# EasyEDA Pro project ProProject_GD32F103C8t6_2024-04-28.epro

# Schematic Schematic1
Create Date: 2024-04-27; Page Name: P1; Project Name: GD32F103C8t6; Schematic Name: Schematic1; Update Date: 2024-04-28; Company: 嘉立创EDA; Page Size: A4; Version: V1.0
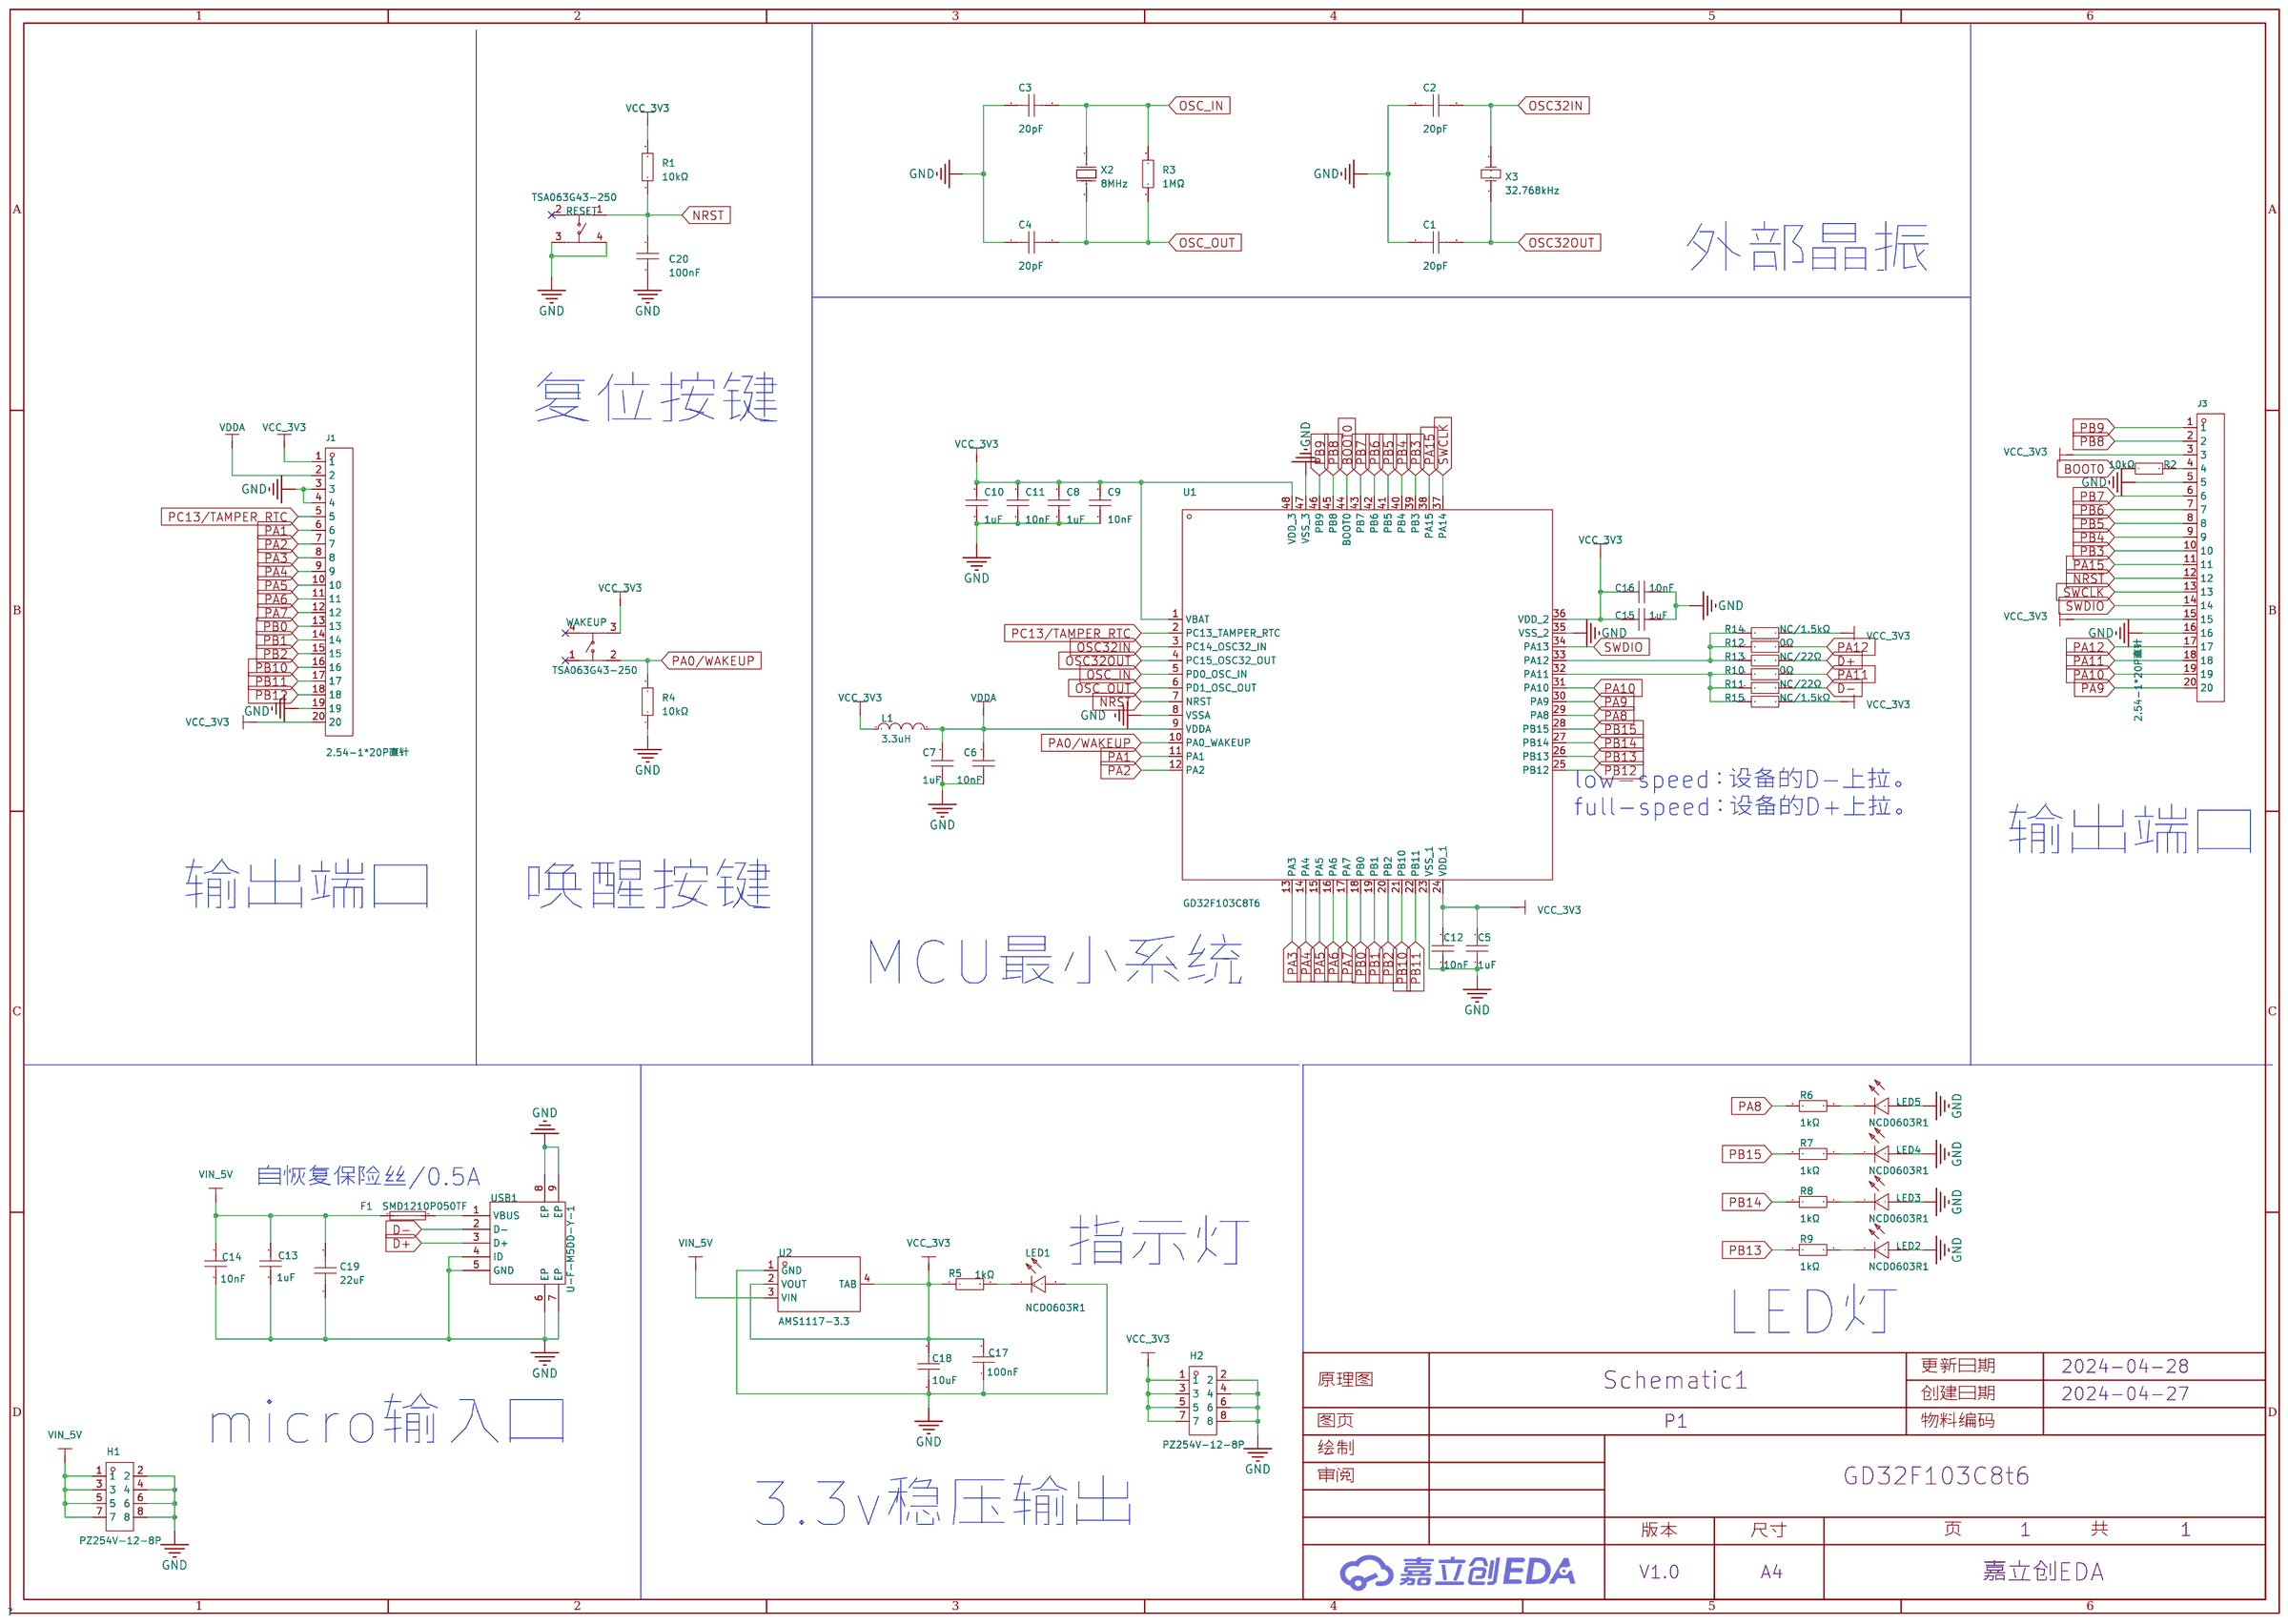
[diagram p0: schematic sheet]

## Parts
C1  20pF  [C0603]
C2  20pF  [C0603]
C3  20pF  [C0603]
C4  20pF  [C0603]
C5  1uF  [C0603]
C6  10nF  [C0603]
C7  1uF  [C0603]
C8  1uF  [C0603]
C9  10nF  [C0603]
C10  1uF  [C0603]
C11  10nF  [C0603]
C12  10nF  [C0603]
C13  1uF  [C0603]
C14  10nF  [C0603]
C15  1uF  [C0603]
C16  10nF  [C0603]
C17  100nF  [C0603]
C18  10uF  [C0805]
C19  22uF  [C0805]
C20  100nF  [C0603]
F1  SMD1210P050TF  [F1210]
H1  PZ254V-12-8P  [HDR-TH_8P-P2.54-V-M-R2-C4-S2.54]
H2  PZ254V-12-8P  [HDR-TH_8P-P2.54-V-M-R2-C4-S2.54]
J1  2.54-1*20P直针  [HDR-TH_20P-P2.54-V-M-1]
J3  2.54-1*20P直针  [HDR-TH_20P-P2.54-V-M-1]
L1  3.3uH  [L0603]
LED1  NCD0603R1  [LED0603-RD_RED]
LED2  NCD0603R1  [LED0603-RD_RED]
LED3  NCD0603R1  [LED0603-RD_RED]
LED4  NCD0603R1  [LED0603-RD_RED]
LED5  NCD0603R1  [LED0603-RD_RED]
R1  10kΩ  [R0603]
R2  10kΩ  [R0603]
R3  1MΩ  [R0603]
R4  10kΩ  [R0603]
R5  1kΩ  [R0603]
R6  1kΩ  [R0603]
R7  1kΩ  [R0603]
R8  1kΩ  [R0603]
R9  1kΩ  [R0603]
R10  0Ω  [R0603]
R11  NC/22Ω  [R0603]
R12  0Ω  [R0603]
R13  NC/22Ω  [R0603]
R14  NC/1.5kΩ  [R0603]
R15  NC/1.5kΩ  [R0603]
RESET  TSA063G43-250  [KEY-SMD_4P-L6.0-W6.0-P4.50-LS10.0]
U1  GD32F103C8T6  [TQFP-48_L7.0-W7.0-P0.50-LS9.0-BL]
U2  AMS1117-3.3  [SOT-223-3_L6.5-W3.5-P3.05-LS7.0]
USB1  U-F-M5DD-Y-1  [MICRO-USB-SMD_U-F-M5DD-Y-1]
WAKEUP  TSA063G43-250  [KEY-SMD_4P-L6.0-W6.0-P4.50-LS10.0]
X2  8MHz  [OSC-TH_L10.0-W4.5-P5.00]
X3  32.768kHz  [OSC-TH_BD3.1-P0.8-D0.3]

## Library data of the parts
C1-C4 = 0603CG200J500NT: 容值:20pF;精度:±5%;额定电压:50V;材质(温度系数):C0G;; LCSC Part Name: 20pF ±5% 50V; Supplier Part: C91702; Manufacturer: FH(风华); Supplier Footprint: 0603; JLCPCB Part Class: 扩展库; Datasheet: https://atta.szlcsc.com/upload/public/pdf/source/20200305/C486355_26A10D38EF8C2A5C37091D0039909270.pdf; Supplier: LCSC; Tolerance: ±5%; Voltage Rated: 50V; Temperature Coefficient: C0G
C5 C7 C8 C10 C13 C15 = CL10A105KP8NNNC: 容值:1uF;精度:±10%;额定电压:10V;材质(温度系数):X5R;; LCSC Part Name: 1uF ±10% 10V; Supplier Part: C26413; Manufacturer: SAMSUNG(三星); Supplier Footprint: 0603; JLCPCB Part Class: 扩展库; Datasheet: https://atta.szlcsc.com/upload/public/pdf/source/20160218/1457707763339.pdf; Supplier: LCSC; Tolerance: ±10%; Voltage Rated: 10V; Temperature Coefficient: X5R
C6 C9 C11 C12 C14 C16 = CC0603KRX7R9BB103: 容值:10nF;精度:±10%;额定电压:50V;材质(温度系数):X7R;; LCSC Part Name: 10nF ±10% 50V; Supplier Part: C100042; Manufacturer: YAGEO(国巨); Supplier Footprint: 0603; JLCPCB Part Class: 扩展库; Datasheet: https://atta.szlcsc.com/upload/public/pdf/source/20181008/C309510_22F155564471FAF6A489F7D68F34234E.pdf; Supplier: LCSC; Tolerance: ±10%; Voltage Rated: 50V; Temperature Coefficient: X7R
C17 C20 = 0603B104K500NT: 容值:100nF;精度:±10%;额定电压:50V;材质(温度系数):X7R;; LCSC Part Name: 100nF ±10% 50V; Supplier Part: C30926; Manufacturer: FH(风华); Supplier Footprint: 0603; JLCPCB Part Class: 扩展库; Datasheet: https://atta.szlcsc.com/upload/public/pdf/source/20200305/C486355_26A10D38EF8C2A5C37091D0039909270.pdf; Supplier: LCSC; Tolerance: ±10%; Voltage Rated: 50V; Temperature Coefficient: X7R
C18 = CL21A106KAYNNNE_C15850: 容值:10uF;精度:±10%;额定电压:25V;材质(温度系数):X5R;; LCSC Part Name: 10uF ±10% 25V; Supplier Part: C15850; Manufacturer: SAMSUNG(三星); Manufacturer Part: CL21A106KAYNNNE; Supplier Footprint: 0805; JLCPCB Part Class: 基础库; Datasheet: https://atta.szlcsc.com/upload/public/pdf/source/20160218/1457707763339.pdf; Supplier: LCSC; Tolerance: ±10%; Voltage Rated: 25V; Temperature Coefficient: X5R
C19 = CL21A226MAQNNNE: 容值:22uF;精度:±20%;额定电压:25V;材质(温度系数):X5R;; LCSC Part Name: 22uF ±20% 25V; Supplier Part: C45783; Manufacturer: SAMSUNG(三星); Supplier Footprint: 0805; JLCPCB Part Class: 基础库; Datasheet: https://atta.szlcsc.com/upload/public/pdf/source/20160218/1457707763339.pdf; Supplier: LCSC; Tolerance: ±20%; Voltage Rated: 25V; Temperature Coefficient: X5R
F1 = SMD1210P050TF: 最大电压:13.2V;最大电流:100A;保持电流:500mA;跳闸电流:1A;; LCSC Part Name: 0.50A 自恢复型; Supplier Part: C15997; Manufacturer: RUILON(瑞隆源); Supplier Footprint: 1210; JLCPCB Part Class: 扩展库; Datasheet: https://atta.szlcsc.com/upload/public/pdf/source/20200427/C15997_F0890E2A0329AD76630862C098BA0840.pdf; Supplier: LCSC; Operating Voltage (Max): 13.2V; Current Rating (Max): 100A; Hold Current: 500mA; Trip Current: 1A
H1 H2 = PZ254V-12-8P: 插针结构:2x4P;间距:2.54mm;行距:2.54mm;圆针/方针:方针;安装类型:直插;排数:双排;总PIN位数:8P;额定电流:-;额定电压:-;配合针长度:6mm;塑高:2.5mm;端接针长度:3mm;触头材质:黄铜;触头镀层:-;工作温度范围:-40℃~+105℃;颜色:黑色;; LCSC Part Name: 间距:2.54mm 2x4P 直插 方针; Supplier Part: C492421; Manufacturer: XFCN(兴飞); Supplier Footprint: 插件,P=2.54mm; JLCPCB Part Class: 扩展库; Datasheet: https://atta.szlcsc.com/upload/public/pdf/source/20200309/C492421_DC8A206AF99CD7755BD4A5B0BC48200B.pdf; Supplier: LCSC; Pin Structure: 2x4P; Pitch: 2.54mm; Row Spacing: 2.54mm; Circluar Pins/Square Pins: 方针; Mounting Type: 直插; Number of Rows: 双排; Number of Pins: 8P; Length of Mating Pin: 6mm; Insulation Height: 2.5mm; Length of End Connection Pin: 3mm; Contact Material: 黄铜; Operating Temperature Range: -40℃~+105℃; Color: 黑色
J1 J3 = 2.54-1*20P直针: 插针结构:1x20P;间距:2.54mm;行距:-;圆针/方针:方针;安装类型:直插;排数:单排;总PIN位数:20P;额定电流:3A;额定电压:-;配合针长度:-;塑高:-;端接针长度:-;触头材质:黄铜;触头镀层:-;工作温度范围:-40℃~+105℃;颜色:黑色;; LCSC Part Name: 间距:2.54mm 1x20P 直插 方针; Supplier Part: C50981; Manufacturer: BOOMELE(博穆精密); Supplier Footprint: 插件,P=2.54mm; JLCPCB Part Class: 扩展库; Datasheet: https://atta.szlcsc.com/upload/public/pdf/source/20151109/1457707572883.pdf; Supplier: LCSC; Pin Structure: 1x20P; Pitch: 2.54mm; Circluar Pins/Square Pins: 方针; Mounting Type: 直插; Number of Rows: 单排; Number of Pins: 20P; Current Rating (Max): 3A; Contact Material: 黄铜; Operating Temperature Range: -40℃~+105℃; Color: 黑色
L1 = CMI160808U3R3KT: 电感值:3.3uH;精度:±10%;额定电流:15mA;饱和电流(Isat):-;直流电阻(DCR):1Ω;; LCSC Part Name: 3.3uH ±10%; Supplier Part: C139209; Manufacturer: FH(风华); Supplier Footprint: 0603; JLCPCB Part Class: 扩展库; Datasheet: https://atta.szlcsc.com/upload/public/pdf/source/20230223/55F203729CE6F04E1707F35DF12034EB.pdf; Supplier: LCSC; Tolerance: ±10%; Rated Current: 15mA; DC Resistance (DCR): 1Ω
LED1-LED5 = NCD0603R1_C84263: 灯头类型:-;发光颜色:红色;正向电压(VF):1.6V~2.6V;功率:65mW;正向电流:20mA;主波长:615nm~630nm;二极管配置:独立二极管;透镜颜色:无色透明透镜;色温:-;发光强度:80mcd~220mcd;发光角度:130°;载带方式:-;工作温度:-30℃~+85℃;; Supplier Part: C84263; Manufacturer: 国星光电; Supplier Footprint: 0603; JLCPCB Part Class: 扩展库; Datasheet: https://atta.szlcsc.com/upload/public/pdf/source/20200820/C84263_DABC6A75E58F576973B407FDBA283D60.pdf; Supplier: LCSC; Emitted Color: 红色; Forward Voltage (VF): 1.6V~2.6V; Power Dissipation: 65mW; Forward Current: 20mA; Dominant Wavelength: 615nm~630nm; Diode Configuration: 独立二极管; Lens Color: 无色透明透镜; Luminous Intensity: 80mcd~220mcd; Viewing Angle: 130°; Operating Temperature: -30℃~+85℃
R1 R2 R4 = RC0603JR-0710KL: 电阻类型:厚膜电阻;阻值:10kΩ;精度:±5%;功率:100mW;最大工作电压:75V;温度系数:±100ppm/℃;; LCSC Part Name: 厚膜电阻 10kΩ ±5% 100mW; Supplier Part: C99198; Manufacturer: YAGEO(国巨); Supplier Footprint: 0603; JLCPCB Part Class: 扩展库; Datasheet: https://atta.szlcsc.com/upload/public/pdf/source/20181223/C99198_917934A193F41F77D9F7D214A8C79116.pdf; Supplier: LCSC; Type: 厚膜电阻; Tolerance: ±5%; Power(Watts): 100mW; Overload Voltage (Max): 75V; Temperature Coefficient: ±100ppm/℃; Operating Temperature Range: -55℃~+155℃
R3 = RC0603JR-071ML: 电阻类型:厚膜电阻;阻值:1MΩ;精度:±5%;功率:100mW;最大工作电压:75V;温度系数:±100ppm/℃;; LCSC Part Name: 厚膜电阻 1MΩ ±5% 100mW; Supplier Part: C107698; Manufacturer: YAGEO(国巨); Supplier Footprint: 0603; JLCPCB Part Class: 扩展库; Datasheet: https://atta.szlcsc.com/upload/public/pdf/source/20180316/70C0E2BDAE7FCC62C531A5A58D202EE1.pdf; Supplier: LCSC; Type: 厚膜电阻; Tolerance: ±5%; Power(Watts): 100mW; Overload Voltage (Max): 75V; Temperature Coefficient: ±100ppm/℃; Operating Temperature Range: -55℃~+155℃
R5-R9 = RT0603BRD071KL: 电阻类型:薄膜电阻;阻值:1kΩ;精度:±0.1%;功率:100mW;最大工作电压:75V;温度系数:±25ppm/℃;; LCSC Part Name: 薄膜电阻 1kΩ ±0.1% 100mW; Supplier Part: C110776; Manufacturer: YAGEO(国巨); Supplier Footprint: 0603; JLCPCB Part Class: 扩展库; Datasheet: https://atta.szlcsc.com/upload/public/pdf/source/20170704/1499151282044.pdf; Supplier: LCSC; Type: 薄膜电阻; Tolerance: ±0.1%; Power(Watts): 100mW; Overload Voltage (Max): 75V; Temperature Coefficient: ±25ppm/℃; Operating Temperature Range: -55℃~+155℃
R10 R12 = 0603WAJ0000T5E: 电阻类型:厚膜电阻;阻值:0Ω;精度:±5%;功率:100mW;最大工作电压:75V;温度系数:±800ppm/℃;; LCSC Part Name: 0Ω ±5% 100mW 厚膜电阻; Supplier Part: C15402; Manufacturer: UNI-ROYAL(厚声); Supplier Footprint: 0603; JLCPCB Part Class: 扩展库; Datasheet: https://atta.szlcsc.com/upload/public/pdf/source/20200306/C422600_1E6D84923E4A46A82E41ADD87F860B5C.pdf; Supplier: LCSC; Type: 厚膜电阻; Tolerance: ±5%; Power(Watts): 100mW; Overload Voltage (Max): 75V; Temperature Coefficient: ±800ppm/℃; Operating Temperature Range: -55℃~+155℃
R11 R13 = RS-03K22R0FT: 电阻类型:厚膜电阻;阻值:22Ω;精度:±1%;功率:100mW;最大工作电压:50V;温度系数:±100ppm/℃;; LCSC Part Name: 厚膜电阻 22Ω ±1% 100mW; Supplier Part: C174301; Manufacturer: FH(风华); Supplier Footprint: 0603; JLCPCB Part Class: 扩展库; Datasheet: https://atta.szlcsc.com/upload/public/pdf/source/20140616/1457707091974.pdf; Supplier: LCSC; Type: 厚膜电阻; Tolerance: ±1%; Power(Watts): 100mW; Overload Voltage (Max): 50V; Temperature Coefficient: ±100ppm/℃; Operating Temperature Range: -55℃~+155℃
R14 R15 = RS-03K1501FT: 电阻类型:厚膜电阻;阻值:1.5kΩ;精度:±1%;功率:100mW;最大工作电压:50V;温度系数:±100ppm/℃;; LCSC Part Name: 厚膜电阻 1.5kΩ ±1% 100mW; Supplier Part: C118397; Manufacturer: FH(风华); Supplier Footprint: 0603; JLCPCB Part Class: 扩展库; Datasheet: https://atta.szlcsc.com/upload/public/pdf/source/20140616/1457707091974.pdf; Supplier: LCSC; Type: 厚膜电阻; Tolerance: ±1%; Power(Watts): 100mW; Overload Voltage (Max): 50V; Temperature Coefficient: ±100ppm/℃; Operating Temperature Range: -55℃~+155℃
RESET WAKEUP = TSA063G43-250: 电路结构:单刀单掷;按钮形状:圆形按钮;作用力:250gf;安装方式:立贴;开关长度:6.1mm;开关宽度:6.1mm;开关高度:4.3mm;带支架:不带;触点电流:50mA;额定电压(DC):12V;绝缘电阻:100MΩ;带灯:无;机械寿命:5万次;; LCSC Part Name: 6.1*6.1*4.3mm 立贴 轻触开关; Supplier Part: C294564; Manufacturer: BRIGHT(博瑞泰); Supplier Footprint: SMD; JLCPCB Part Class: 扩展库; Datasheet: https://atta.szlcsc.com/upload/public/pdf/source/20181029/C294570_15EFF1F4D215547575AD6307D8A439BB.pdf; Supplier: LCSC; Circuit: 单刀单掷; Actuator Style: 圆形按钮; Operating Force: 250gf; Mounting Style: 立贴; Switch Length: 6.1mm; Switch Width: 6.1mm; Switch Height: 4.3mm; Strike Gundam: 不带; Contact Current: 50mA; Voltage Rating (DC): 12V; Insulation Resistance: 100MΩ; Actuator/Cap Color: 黑色; With Lamp: 无; Pin Style: 鸥翼型; Mechanical Life: 5万次; Operating Temperature: -25℃~+70℃
U1 = GD32F103C8T6: CPU内核:CM3;程序存储容量:64KB;RAM总容量:20KB;GPIO端口数量:37;工作电压范围:2.6V~3.6V;CPU最大主频:108MHz;程序存储器类型:FLASH;; LCSC Part Name: Arm® Cortex®-M3 32-bit MCU; Supplier Part: C77994; Manufacturer: GigaDevice(兆易创新); Supplier Footprint: LQFP-48(7x7); JLCPCB Part Class: 扩展库; Datasheet: https://atta.szlcsc.com/upload/public/pdf/source/20160910/1473490296871.pdf; Supplier: LCSC; CPU Core: CM3; Program Storage Size: 64KB; RAM Size: 20KB; GPIO Ports Number: 37; Operating Voltage Range: 2.6V~3.6V; CPU Maximum Speed: 108MHz; Program Memory Type: FLASH; Operating Temperature Range: -40℃~+85℃; ADC (Bit): 12bit; PWM (Bit): 16bit; 16Bit Timer: 3; CAN: 1; UART/USART: 3; I2C: 2; SPI: 2; Universal Serial Bus: 有; Peripheral/Function: 片载温度传感器；DMA；看门狗；LIN总线协议；PWM；IrDA；SDIO；RTC实时时钟; Watchdog: 有; Real-Time Clock: 有; Infrared Data Association: 有; Secure Digital Input and Output: 有; Direct Memory Access: 有; Internal Oscillator: 有
U2 = AMS1117-3.3_C5250992: 输出类型：固定 输出极性：正 最大输入电压：18V 输出电压：3.3V 输出电流：1A 电源纹波抑制比(PSRR)：60dB@(120Hz)。当前应用较多领域：三端稳压器，机顶盒; Supplier Part: C5250992; Manufacturer: TWGMC(台湾迪嘉); Supplier Footprint: SOT-223-3L; JLCPCB Part Class: 扩展库; Datasheet: https://atta.szlcsc.com/upload/public/pdf/source/20221109/A58A92B07670E85D28928AE371260E8D.pdf; Supplier: LCSC
USB1 = U-F-M5DD-Y-1: 连接器类型:Micro-B;标准:USB 2.0;公母:母;端口数量:1;触点数量:5P;额定电流 - 电源:1A;; LCSC Part Name: Micro-B 母; Supplier Part: C91467; Manufacturer: 韩国韩荣; Supplier Footprint: SMD; JLCPCB Part Class: 扩展库; Datasheet: https://atta.szlcsc.com/upload/public/pdf/source/20190321/C91467_7D0E0328BDB3D0105DB79E7E785438EE.pdf; Supplier: LCSC; Connector Type: Micro-B; Standard: USB 2.0; Gender: 母; Number of Ports: 1; Number of Contacts: 5P; Current Rating - Power (Max): 1A
X2 = X49SD8MSD2SC: 晶振类型:直插晶振;频率:8MHz;常温频差:±20ppm;外接负载电容:20pF;频率稳定度(全温):±30ppm;; LCSC Part Name: 8MHz ±20ppm 20pF; Supplier Part: C21263; Manufacturer: YXC(扬兴晶振); Supplier Footprint: HC-49S; JLCPCB Part Class: 扩展库; Datasheet: https://atta.szlcsc.com/upload/public/pdf/source/20240329/977D7F2434F98B2BE33270BB9FF3D86D.pdf; Supplier: LCSC; Crystal Type: 直插晶振; Normal temperature Frequency Tolerance: ±20ppm; External load capacitor: 20pF; Frequency Stability(Full temperature range): ±30ppm; Operating Temperature: -20℃~+70℃
X3 = X308032768KGB2SC: 晶振类型:直插晶振;频率:32.768kHz;常温频差:±10ppm;外接负载电容:12.5pF;频率稳定度(全温):-;; LCSC Part Name: 32.768kHz ±10ppm 12.5pF YT-38; Supplier Part: C52082; Manufacturer: YXC(扬兴晶振); Supplier Footprint: DT-38; JLCPCB Part Class: 扩展库; Datasheet: https://atta.szlcsc.com/upload/public/pdf/source/20240329/231E1A1EB7C875CD193DBE6664A3DE3A.pdf; Supplier: LCSC; Crystal Type: 直插晶振; Normal temperature Frequency Tolerance: ±10ppm; External load capacitor: 12.5pF; Operating Temperature: -20℃~+70℃

## Nets
GND: C1.1 C2.1 C3.1 C4.1 C5.1 C6.1 C7.1 C8.1 C9.1 C10.1 C11.1 C12.1 C13.1 C14.1 C15.1 C16.1 C17.1 C18.1 C19.1 C20.1 H1.2 H1.4 H1.6 H1.8 H2.2 H2.4 H2.6 H2.8 J1.3 J1.4 J1.19 J3.5 J3.16 LED1.2(A) LED2.2(A) LED3.2(A) LED4.2(A) LED5.2(A) R4.1 RESET.3 RESET.4 U1.8(VSSA) U1.23(VSS_1) U1.35(VSS_2) U1.47(VSS_3) U2.1(GND) USB1.4(ID) USB1.5(GND) USB1.6(EP) USB1.7(EP) USB1.8(EP) USB1.9(EP)
VCC_3V3: C5.2 C8.2 C9.2 C10.2 C11.2 C12.2 C15.2 C16.2 C17.2 C18.2 H2.1 H2.3 H2.5 H2.7 J1.1 J1.20 J3.3 J3.15 L1.1 R1.2 R5.1 R14.2 R15.2 U1.1(VBAT) U1.24(VDD_1) U1.36(VDD_2) U1.48(VDD_3) U2.2(VOUT) U2.4(TAB) WAKEUP.3
VDDA: C6.2 C7.2 J1.2 L1.2 U1.9(VDDA)
VIN_5V: C13.2 C14.2 C19.2 F1.1 H1.1 H1.3 H1.5 H1.7 U2.3(VIN)
BOOT0: R2.1 U1.44(BOOT0)
D+: R13.2 USB1.3(D+)
D-: R11.2 USB1.2(D-)
NRST: C20.2 J3.12 R1.1 RESET.1 U1.7(NRST)
OSC32IN: C2.2 U1.3(PC14_OSC32_IN) X3.2(OSC2)
OSC32OUT: C1.2 U1.4(PC15_OSC32_OUT) X3.1(OSC1)
OSC_IN: C3.2 R3.2 U1.5(PD0_OSC_IN) X2.1(OSC1)
OSC_OUT: C4.2 R3.1 U1.6(PD1_OSC_OUT) X2.2(OSC2)
PA0/WAKEUP: R4.2 U1.10(PA0_WAKEUP) WAKEUP.2
PA1: J1.6 U1.11(PA1)
PA2: J1.7 U1.12(PA2)
PA3: J1.8 U1.13(PA3)
PA4: J1.9 U1.14(PA4)
PA5: J1.10 U1.15(PA5)
PA6: J1.11 U1.16(PA6)
PA7: J1.12 U1.17(PA7)
PA8: R6.1 U1.29(PA8)
PA9: J3.20 U1.30(PA9)
PA10: J3.19 U1.31(PA10)
PA11: J3.18 R10.2
PA12: J3.17 R12.2
PA15: J3.11 U1.38(PA15)
PB0: J1.13 U1.18(PB0)
PB1: J1.14 U1.19(PB1)
PB2: J1.15 U1.20(PB2)
PB3: J3.10 U1.39(PB3)
PB4: J3.9 U1.40(PB4)
PB5: J3.8 U1.41(PB5)
PB6: J3.7 U1.42(PB6)
PB7: J3.6 U1.43(PB7)
PB8: J3.2 U1.45(PB8)
PB9: J3.1 U1.46(PB9)
PB10: J1.16 U1.21(PB10)
PB11: J1.17 U1.22(PB11)
PB12: J1.18 U1.25(PB12)
PB13: R9.1 U1.26(PB13)
PB14: R8.1 U1.27(PB14)
PB15: R7.1 U1.28(PB15)
PC13/TAMPER_RTC: J1.5 U1.2(PC13_TAMPER_RTC)
SWCLK: J3.13 U1.37(PA14)
SWDIO: J3.14 U1.34(PA13)
$1N292: LED5.1(K) R6.2
$1N400: LED4.1(K) R7.2
$1N509: LED3.1(K) R8.2
$1N618: LED2.1(K) R9.2
$1N1383: LED1.1(K) R5.2
$1N2109: F1.2 USB1.1(VBUS)
$1N4818: J3.4 R2.2
$1N7464: R12.1 R13.1 R14.1 U1.33(PA12)
$1N7486: R10.1 R11.1 R15.1 U1.32(PA11)

Not connected (* = marked no-connect by the designer): RESET 2*; WAKEUP 1* 4*

## Notes on the sheet
- 外部晶振
- 复位按键
- low-speed：设备的D-上拉。
  full-speed：设备的D+上拉。
- 输出端口
- 输出端口
- 唤醒按键
- MCU最小系统
- 自恢复保险丝/0.5A
- 指示灯
- LED灯
- micro输入口
- 3.3v稳压输出

# Board PCB1
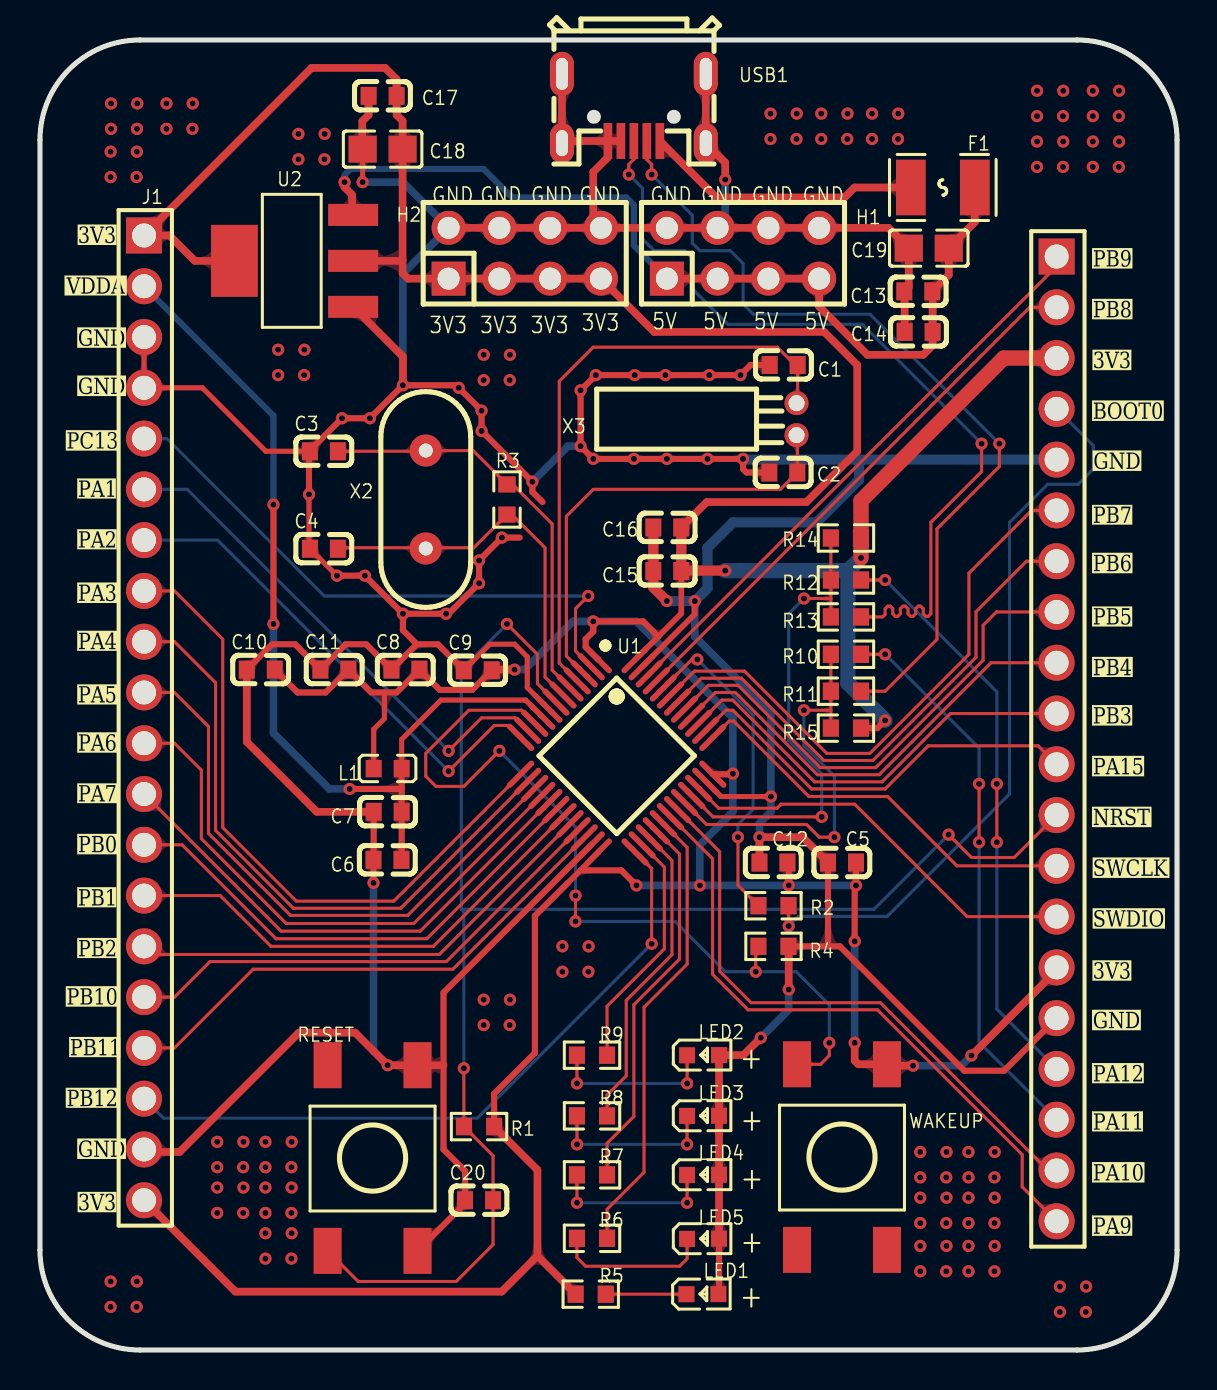
[diagram p1: board, top side]
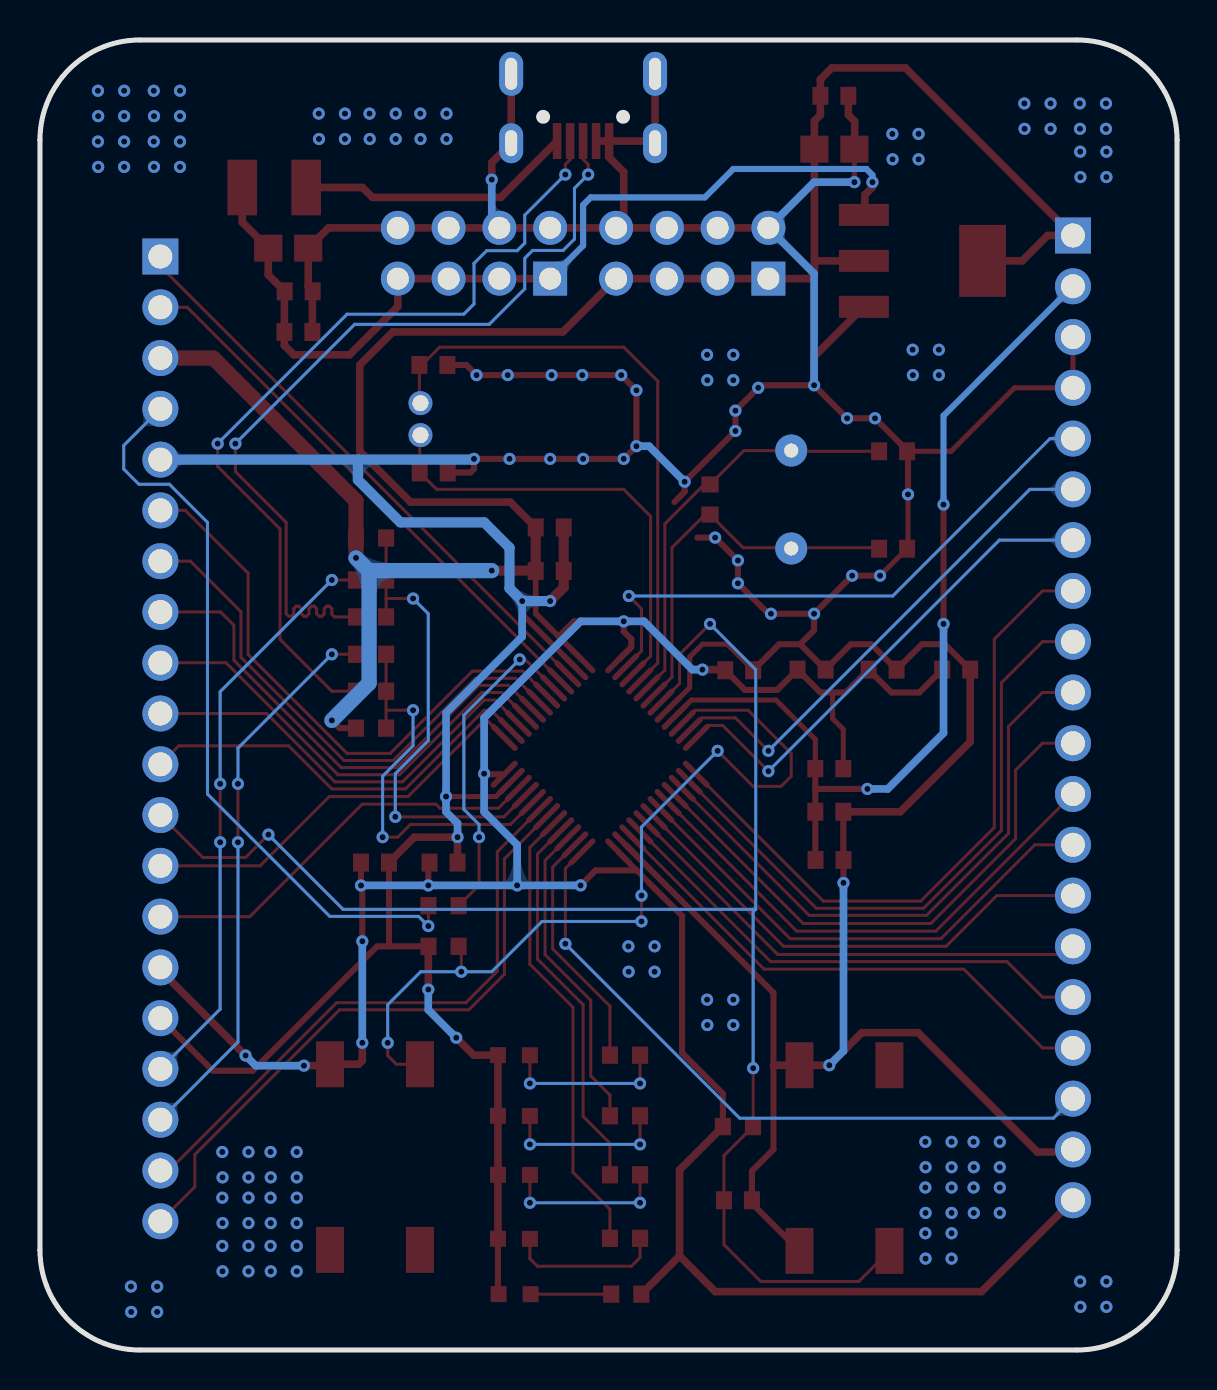
[diagram p2: board, bottom side, seen from below]

Outline 56.9 x 65.53 mm; copper layers: Top Layer, Bottom Layer. Coordinates in mm from the lower left corner of the outline.
Outline path: 0,60.53 0,5 arc(1.46,1.46) 5,0 51.9,0 arc(55.43,1.46) 56.9,5 56.9,60.53 arc(55.43,64.07) 51.9,65.53 5,65.53 arc(1.46,64.07) 0,60.53
Stack: Top Layer 0.035mm / Dielectric1 1.51mm FR4 er 4.5 / Bottom Layer 0.035mm

## Design rules (mm)
net GND: power
net VCC_3V3: power
net VIN_5V: power
net D+: DP1
net D-: DP1
net $1N2109: power
net VDDA: power
template: 自定义配置
spacing copperThickness1oz (default): track to track 0.203, other pairs 0.152 to 0.3
spacing copperThickness2oz: track to track 0.203, other pairs 0.152 to 0.3
track width copperThickness1oz (default): min 0.152, default 0.152, max 0.508
track width copperThickness2oz: min 0.203, default 0.254, max 2.54
track width power: min 0.254, default 0.305, max 5.08
differential pair differentialPair (default): width min 0.152, default 0.152, max 2.54; gap min 0.152, default 0.152
via viaSize (default): diameter min 0.5, default 0.61, max 10; hole min 0.3, default 0.305, max 6.299
net class power uses power
net GND uses power
net VCC_3V3 uses power
net VIN_5V uses power
net $1N2109 uses power
net VDDA uses power

## Placement (name value [footprint] x y rotation side)
C1  20pF  [C0603]  37.21 49.28 0 top
C2  20pF  [C0603]  37.2 43.9 0 top
C3  20pF  [C0603]  14.21 44.96 0 top
C4  20pF  [C0603]  14.21 40.08 0 top
C5  1uF  [C0603]  40.13 24.38 0 top
C6  10nF  [C0603]  17.39 24.52 0 top
C7  1uF  [C0603]  17.4 26.92 0 top
C8  1uF  [C0603]  18.29 34.04 0 top
C9  10nF  [C0603]  21.91 34 0 top
C10  1uF  [C0603]  11.05 34.04 0 top
C11  10nF  [C0603]  14.73 34.04 0 top
C12  10nF  [C0603]  36.7 24.38 0 top
C13  1uF  [C0603]  43.95 52.96 0 top
C14  10nF  [C0603]  43.97 50.93 0 top
C15  1uF  [C0603]  31.39 38.97 0 top
C16  10nF  [C0603]  31.39 41.15 0 top
C17  100nF  [C0603]  17.14 62.74 0 top
C18  10uF  [C0805]  17.14 60.07 0 top
C19  22uF  [C0805]  44.47 55.12 0 top
C20  100nF  [C0603]  21.97 7.49 0 top
F1  SMD1210P050TF  [F1210]  45.18 58.15 180 top
H1  PZ254V-12-8P  [HDR-TH_8P-P2.54-V-M-R2-C4-S2.54]  35.18 54.86 0 top
H2  PZ254V-12-8P  [HDR-TH_8P-P2.54-V-M-R2-C4-S2.54]  24.26 54.86 0 top
J1  2.54-1*20P直针  [HDR-TH_20P-P2.54-V-M-1]  5.21 31.62 270 top
J3  2.54-1*20P直针  [HDR-TH_20P-P2.54-V-M-1]  50.87 30.57 270 top
L1  3.3uH  [L0603]  17.4 29.08 0 top
LED1  NCD0603R1  [LED0603-RD_RED]  33.15 2.79 0 top
LED2  NCD0603R1  [LED0603-RD_RED]  33.18 14.75 0 top
LED3  NCD0603R1  [LED0603-RD_RED]  33.18 11.71 0 top
LED4  NCD0603R1  [LED0603-RD_RED]  33.18 8.76 0 top
LED5  NCD0603R1  [LED0603-RD_RED]  33.18 5.56 0 top
R1  10kΩ  [R0603]  21.97 11.18 0 top
R2  10kΩ  [R0603]  36.7 22.22 0 top
R3  1MΩ  [R0603]  23.37 42.54 90 top
R4  10kΩ  [R0603]  36.7 20.19 180 top
R5  1kΩ  [R0603]  27.56 2.79 0 top
R6  1kΩ  [R0603]  27.62 5.59 180 top
R7  1kΩ  [R0603]  27.62 8.76 180 top
R8  1kΩ  [R0603]  27.62 11.71 180 top
R9  1kΩ  [R0603]  27.62 14.75 180 top
R10  0Ω  [R0603]  40.33 34.8 0 top
R11  NC/22Ω  [R0603]  40.33 32.96 0 top
R12  0Ω  [R0603]  40.33 38.52 0 top
R13  NC/22Ω  [R0603]  40.33 36.67 0 top
R14  NC/1.5kΩ  [R0603]  40.33 40.62 0 top
R15  NC/1.5kΩ  [R0603]  40.33 31.11 0 top
RESET  TSA063G43-250  [KEY-SMD_4P-L6.0-W6.0-P4.50-LS10.0]  16.64 9.6 0 top
U1  GD32F103C8T6  [TQFP-48_L7.0-W7.0-P0.50-LS9.0-BL]  28.86 29.72 225 top
U2  AMS1117-3.3  [SOT-223-3_L6.5-W3.5-P3.05-LS7.0]  12.7 54.48 0 top
USB1  U-F-M5DD-Y-1  [micro-usb-smd_u-f-m5dd-y-1]  29.72 62.1 90 top
WAKEUP  TSA063G43-250  [KEY-SMD_4P-L6.0-W6.0-P4.50-LS10.0]  40.13 9.65 0 top
X2  8MHz  [OSC-TH_L10.0-W4.5-P5.00]  19.3 42.54 0 top
X3  32.768kHz  [OSC-TH_BD3.1-P0.8-D0.3]  37.86 46.56 0 top

## Footprints (pads in the part's own frame, mm; a bottom-side part is the same pattern mirrored in y, then rotated)
C0603
  rect 0.8x0.9 smd: 1(-0.7,0) 2(0.7,0)
C0805
  rect 1.41x1.35 smd: 1(-1,0) 2(1,0)
F1210
  rect 1.485x2.781 smd: 1(-1.6,0) 2(1.6,0)
HDR-TH_8P-P2.54-V-M-R2-C4-S2.54
  rect 1.7x1.7 hole 1.1: 1(-3.81,-1.27)
  round 1.7 hole 1.1: 2(-3.81,1.27) 3(-1.27,-1.27) 4(-1.27,1.27) 5(1.27,-1.27) 6(1.27,1.27) 7(3.81,-1.27) 8(3.81,1.27)
HDR-TH_20P-P2.54-V-M-1
  rect 1.8x1.8 hole 1.2: 1(-24.13,0)
  round 1.8 hole 1.2: 2(-21.59,0) 3(-19.05,0) 4(-16.51,0) 5(-13.97,0) 6(-11.43,0) 7(-8.89,0) 8(-6.35,0) 9(-3.81,0) 10(-1.27,0) 11(1.27,0) 12(3.81,0) 13(6.35,0) 14(8.89,0) 15(11.43,0) 16(13.97,0) 17(16.51,0) 18(19.05,0) 19(21.59,0) 20(24.13,0)
KEY-SMD_4P-L6.0-W6.0-P4.50-LS10.0
  rect 1.4x2.3 smd: 1(-2.25,-4.643) 2(-2.25,4.643) 3(2.25,4.643) 4(2.25,-4.643)
L0603
  rect 0.8x0.864 smd: 1(-0.7,0) 2(0.7,0)
LED0603-RD_RED
  rect 0.8x0.8 smd: 1(-0.799,-0.004) 2(0.799,0.004)
micro-usb-smd_u-f-m5dd-y-1
  rect 1.8x0.43 smd: 1(-1.626,-1.3) 2(-1.626,-0.65) 3(-1.626,0) 4(-1.626,0.65) 5(-1.626,1.3)
  oval 2x1.2 hole 1.3x0.6: 6(-1.735,3.599) 8(-1.735,-3.599)
  oval 2.2x1.2 hole 1.6x0.6: 7(1.735,3.599) 9(1.735,-3.599)
OSC-TH_BD3.1-P0.8-D0.3
  round 1.2 hole 0.8: 1(0,0.8) 2(0,-0.8)
OSC-TH_L10.0-W4.5-P5.00
  round 1.6 hole 0.7: 1(0,2.45) 2(0,-2.45)
R0603
  rect 0.806x0.864 smd: 1(-0.753,0) 2(0.753,0)
SOT-223-3_L6.5-W3.5-P3.05-LS7.0
  rect 2.5x1.1 smd: 1(2.97,-2.3) 2(2.97,0) 3(2.97,2.3)
  rect 2.34x3.6 smd: 4(-2.97,0)
TQFP-48_L7.0-W7.0-P0.50-LS9.0-BL
  oval 0.28x1.8 smd: 1(-2.75,-4.05) 2(-2.25,-4.05) 3(-1.75,-4.05) 4(-1.25,-4.05) 5(-0.75,-4.05) 6(-0.25,-4.05) 7(0.25,-4.05) 8(0.75,-4.05) 9(1.25,-4.05) 10(1.75,-4.05) 11(2.25,-4.05) 12(2.75,-4.05) 25(2.75,4.05) 26(2.25,4.05) 27(1.75,4.05) 28(1.25,4.05) 29(0.75,4.05) 30(0.25,4.05) 31(-0.25,4.05) 32(-0.75,4.05) 33(-1.25,4.05) 34(-1.75,4.05) 35(-2.25,4.05) 36(-2.75,4.05)
  oval 1.8x0.28 smd: 13(4.05,-2.75) 14(4.05,-2.25) 15(4.05,-1.75) 16(4.05,-1.25) 17(4.05,-0.75) 18(4.05,-0.25) 19(4.05,0.25) 20(4.05,0.75) 21(4.05,1.25) 22(4.05,1.75) 23(4.05,2.25) 24(4.05,2.75) 37(-4.05,2.75) 38(-4.05,2.25) 39(-4.05,1.75) 40(-4.05,1.25) 41(-4.05,0.75) 42(-4.05,0.25) 43(-4.05,-0.25) 44(-4.05,-0.75) 45(-4.05,-1.25) 46(-4.05,-1.75) 47(-4.05,-2.25) 48(-4.05,-2.75)

## Nets
As in the schematic.

Pads without a net: RESET 2; WAKEUP 1 4

## Via types
v1: diameter 0.61, hole 0.305, Top Layer to Bottom Layer, 202 vias

## Routing (per net, layer and track width the routed paths; a pad name or vN(x,y) marks a point on that pad's centre or on a via; arc(x,y) is an arc through that point)
GND: length 336.2
  Top Layer w0.254: v1(36.58,27.69) 34.08,27.69 U1.35 ; v1(16.14,58.42) C18.1 ; v1(14.86,38.73) 14.86,38.73 13.46,40.13 v1(13.46,42.8) ; 13.51,44.96 11.3,44.96 8.13,48.13 J1.4 J1.3 ; C9.1 22.51,35.31 23.75,35.31 24.38,34.67 24.38,33.14 U1.8
  Top Layer w0.28: 30.13,34.18 32.77,36.81 v1(32.77,37.46)
  Top Layer w0.305: C9.1 19.91,35.31 18.86,35.31 ; v1(14.86,38.73) v1(16.26,38.73) v1(18.16,36.83) ; v1(16.69,23.37) C6.1 16.7,24.53 C7.1 ; C5.1 39.43,20.19 ; J3.16 48.24,13.97 46.25,13.97 40.03,20.19 R4.1 ; C10.1 11.62,35.31 12.76,35.31 C11.1 15.3,35.31 16.32,35.31 C8.1 18.86,35.31 ; U1.23 20.19,17.87 20.19,10.03 21.27,8.95 C20.1 21.27,7.34 RESET.4 ; 18.86,35.31 18.16,36 v1(18.16,36.83) ; v1(18.16,36.83) v1(20.32,36.83) 20.45,36.83 v1(21.97,38.35) v1(21.97,39.5) v1(23.11,40.64) 24,40.64 ; C2.1 35.35,43.9 35.18,44.07 v1(35.18,44.58) v1(33.4,44.58) v1(31.37,44.58) v1(29.72,44.58) v1(27.69,44.58) v1(27.05,45.21) v1(27.05,48.01) v1(27.81,48.77) v1(29.76,48.77) v1(31.3,48.77) v1(33.49,48.77) v1(35.05,48.77) 35.56,49.28 C1.1 ; 25.15,42.42 24.64,42.93 v1(24.64,43.43) v1(22.1,45.97) v1(22.1,46.99) v1(20.95,48.13) 20.83,48.26 v1(18.16,48.26) v1(16.51,46.61) v1(15.11,46.61) 13.51,45 13.51,44.96 13.46,44.91 v1(13.46,42.8) ; LED5.2 33.98,2.83 LED1.2
  Top Layer w0.381: U2.1 18.16,49.69 v1(18.16,48.26) ; H2.8 H1.2 H1.4 H1.6 H1.8 42.46,56.13 C19.1 43.47,53.18 C13.1 43.27,52.94 C14.1 ; H2.8 H2.6 H2.4 H2.2 ; H2.8 27.69,56.51 27.69,58.93 28.42,59.66 USB1.5 ; USB1.5 USB1.4 ; USB1.5 26.23,60.48 USB1.6 USB1.7 ; USB1.9 USB1.8 34.29,59.4 v1(34.29,58.55) ; 20.19,14.25 RESET.3 v1(17.4,14.25) 15.77,15.87 12.95,15.87 6.98,9.91 5.33,9.91 J1.19 ; 34.23,14.75 35.2,14.75 v1(36.07,15.62) ; C5.1 38.16,25.65 v1(36,25.65) C12.1 ; R4.1 37.47,20.18 v1(37.47,18.03) ; 33.98,14.8 LED3.2 LED4.2 LED5.2 ; C7.1 13.84,26.92 10.35,30.42 C10.1 ; C18.1 16.13,60.09 16.13,61.47 16.45,61.78 C17.1
  Top Layer w0.508: v1(31.37,37.46) 30.69,38.14 C15.1 C16.1
  Bottom Layer w0.381: v1(18.16,48.26) 18.16,53.85 H2.2 18.16,58.42 v1(16.14,58.42) ; H1.4 34.29,56.51 v1(34.29,58.55) ; v1(24.64,43.43) 26.42,45.21 v1(27.05,45.21) ; v1(16.69,23.37) 16.69,14.96 v1(17.4,14.25) ; v1(37.47,18.03) 37.47,17.02 v1(36.07,15.62) ; v1(36,25.65) 36,26.35 36.58,26.92 v1(36.58,27.69) 36.58,31.88 32.77,35.69 v1(32.77,37.46)
  Bottom Layer w0.508: v1(35.18,44.58) 35.22,44.54 40.99,44.54 ; 40.99,44.54 J3.5 ; 40.99,44.54 40.99,43.53 38.86,41.4 34.67,41.4 33.4,40.13 33.4,38.1 v1(32.77,37.46) v1(31.37,37.46)
  vias: v1(3.56,62.36) v1(3.56,61.09) v1(3.54,59.94) v1(3.54,58.67) v1(3.54,3.43) v1(3.54,2.16) v1(4.87,62.36) v1(4.86,61.09) v1(4.85,59.94) v1(4.84,58.67) v1(4.85,3.43) v1(4.84,2.16) v1(6.33,62.36) v1(6.33,61.09) v1(7.64,62.36) v1(7.63,61.09) v1(8.87,10.41) v1(8.87,9.14) v1(8.87,8.13) v1(8.87,6.86) v1(10.18,10.41) v1(10.17,9.14) v1(10.18,8.13) v1(10.17,6.86) v1(11.28,10.41) v1(11.28,9.14) v1(11.28,8.13) v1(11.28,6.86) v1(11.28,5.84) v1(11.28,4.57) v1(11.92,50.04) v1(11.92,48.77) v1(12.59,10.41) v1(12.58,9.14) v1(12.59,8.13) v1(12.58,6.86) v1(12.59,5.84) v1(12.58,4.57) v1(12.93,60.83) v1(12.93,59.56) v1(13.23,50.04) v1(13.22,48.77) v1(14.24,60.83) v1(14.23,59.56) v1(22.2,49.78) v1(22.2,48.51) v1(22.2,17.53) v1(22.2,16.26) v1(23.52,49.78) v1(23.5,48.51) v1(23.52,17.53) v1(23.5,16.26) v1(26.14,20.19) v1(26.14,18.92) v1(27.45,20.19) v1(27.44,18.92) v1(36.55,61.85) v1(36.55,60.58) v1(37.87,61.85) v1(37.86,60.58) v1(39.1,61.85) v1(39.1,60.58) v1(40.39,60.58) v1(40.41,61.85) v1(41.64,61.85) v1(41.64,60.58) v1(42.95,61.85) v1(42.94,60.58) v1(44.05,9.91) v1(44.05,8.64) v1(44.05,7.62) v1(44.05,6.35) v1(44.05,5.21) v1(44.05,3.94) v1(45.36,9.91) v1(45.35,8.64) v1(45.36,7.62) v1(45.35,6.35) v1(45.36,5.21) v1(45.35,3.94) v1(46.46,9.91) v1(46.46,8.64) v1(46.46,7.62) v1(46.46,6.35) v1(46.46,5.21) v1(46.46,3.94) v1(47.77,9.91) v1(47.76,8.64) v1(47.77,7.62) v1(47.76,6.35) v1(47.77,5.21) v1(47.76,3.94) v1(49.89,62.99) v1(49.89,61.72) v1(49.89,60.45) v1(49.89,59.18) v1(51.03,3.17) v1(51.03,1.91) v1(51.19,61.72) v1(51.19,59.18) v1(51.2,62.99) v1(51.2,60.45) v1(52.35,3.17) v1(52.33,1.91) v1(52.68,62.99) v1(52.68,61.72) v1(52.68,60.45) v1(52.68,59.18) v1(54,62.99) v1(53.98,61.72) v1(54,60.45) v1(53.98,59.18)
VCC_3V3: length 249.6
  Top Layer w0.254: L1.1 16.7,31.05 17.23,31.59 17.23,32.89
  Top Layer w0.28: 32.09,38.97 32.09,36.84 30.94,35.69 U1.48 ; 26.42,23.37 27.94,24.89 27.94,24.91
  Top Layer w0.305: 27.94,34.53 27.3,35.17 27.3,35.56 27.69,35.94 v1(27.69,36.45) 30.18,36.45 30.94,35.69 ; 26.42,23.37 24.77,21.72 24.77,14.86 22.72,12.82 R1.2 ; U1.36 34.65,28.8 v1(34.67,28.83) ; v1(29.85,23.24) 29.09,23.99 27.04,23.99 ; R15.2 41.9,31.11 v1(42.29,31.5) ; C10.2 12.89,32.89 14.29,32.89 C11.2 16.58,32.89 17.85,32.89 18.99,34.04 20,33.02 21.62,33.02 C9.2 ; C12.2 37.47,24.32 v1(37.47,23.24) ; v1(40.77,20.45) 40.77,23.17 v1(40.83,23.24) 40.83,24.38
  Top Layer w0.381: 24.89,4.71 24.89,9.01 R1.2 ; 24.89,4.71 23.11,2.92 9.78,2.92 J1.20 ; 24.89,4.71 R5.1 ; v1(46.61,14.73) 50.87,18.99 J3.15 ; v1(43.69,14.22) 42.45,14.22 WAKEUP.3 40.95,14.29 40.77,14.48 v1(40.77,15.37) ; 18.14,54.48 U2.2 ; 32.09,41.15 33.36,42.42 38.35,42.42 40.89,44.96 40.89,49.28 39.24,50.93 30.73,50.93 H2.7 H2.5 H2.3 H2.1 18.42,53.59 18.14,53.86 C18.2 18.14,61.48 17.85,61.78 C17.2 17.85,63.56 17.27,64.13 13.59,64.13 J1.1 6.48,55.75 7.75,54.48 U2.4 ; C9.2 22.64,34.04 v1(23.75,34.04)
  Top Layer w0.508: v1(34.29,38.99) 32.11,38.99 32.09,38.97 32.09,41.15
  Top Layer w0.762: J3.3 48.22,49.62 41.08,42.48 R14.2 v1(41.08,39.62)
  Bottom Layer w0.305: 40.41,38.99 40.43,38.97
  Bottom Layer w0.381: v1(33.02,23.24) v1(37.47,23.24) 40.83,23.24 v1(40.83,23.24) ; v1(33.02,23.24) 33.02,25.27 34.67,26.92 v1(34.67,28.83) 34.67,31.62 29.85,36.45 v1(27.69,36.45) 26.67,36.45 24.26,34.04 v1(23.75,34.04) ; v1(33.02,23.24) v1(29.85,23.24) ; v1(46.61,14.73) 46.1,14.22 v1(43.69,14.22) ; v1(40.77,20.45) v1(40.77,15.37)
  Bottom Layer w0.762: v1(42.29,31.5) 40.43,33.36 40.43,38.97 v1(41.08,39.62) ; v1(34.29,38.99) 40.41,38.99
VDDA: length 46.8
  Top Layer w0.254: L1.2 18.1,30.54 20.07,32.51 24.3,32.51 25.11,31.7
  Top Layer w0.305: L1.2 18.1,28.11 ; 18.1,28.11 C7.2 18.1,24.53 C6.2 ; 18.1,28.11 18.06,28.07 v1(15.49,28.07) ; v1(11.68,42.29) v1(11.68,36.32)
  Bottom Layer w0.305: J1.2 11.68,46.74 v1(11.68,42.29)
  Bottom Layer w0.381: v1(11.68,36.32) 11.68,30.86 14.48,28.07 v1(15.49,28.07)
VIN_5V: length 46.6
  Top Layer w0.381: v1(15.24,58.42) 15.24,58.17 15.62,57.78 15.62,56.83 U2.3 ; H1.1 H1.3 H1.5 H1.7 38.99,52.2 41.4,49.78 44.2,49.78 44.67,50.25 C14.2 44.67,52.94 C13.2 45.47,53.78 C19.2 46.78,56.42 F1.1
  Bottom Layer w0.305: H1.1 29.72,55.24 29.72,57.28 29.34,57.66 23.62,57.66 22.2,59.08 15.55,59.08 15.24,58.78 v1(15.24,58.42)
BOOT0: length 16.5
  Top Layer w0.152: v1(32.89,34.54) 32.62,34.54 31.19,33.12 ; R2.1 34.92,23.25 v1(34.92,25.65)
  Bottom Layer w0.152: v1(34.92,25.65) 34.92,26.29 35.69,27.05 35.69,31.75 v1(32.89,34.54)
D+: length 42.7
  Top Layer w0.152: v1(29.46,58.8) 29.46,59.31 29.72,59.56 USB1.3 ; v1(47.12,45.34) 47.12,43.94 44.58,41.4 44.58,36.83 44.45,36.7 44.32,36.7 44.2,36.83 44.2,37.08 44.07,37.21 43.94,37.21 43.82,37.08 43.82,36.83 43.69,36.7 43.56,36.7 43.43,36.83 43.43,37.08 43.31,37.21 43.18,37.21 43.05,37.08 43.05,36.83 42.93,36.7 42.8,36.7 42.67,36.83 42.67,37.08 42.55,37.21 42.42,37.21 42.29,37.08 42.29,36.8 42.16,36.67 R13.2
  Bottom Layer w0.152: v1(29.46,58.8) 30.15,58.11 30.15,55.57 30.72,55 32.24,55 32.64,54.61 32.64,53.09 34.42,51.31 41.15,51.31 v1(47.12,45.34)
D-: length 42.7
  Top Layer w0.152: R11.2 42.29,32.96 44.88,35.55 44.88,41.07 48.01,44.2 v1(48.01,45.34) ; v1(30.61,58.8) 30.61,59.31 30.37,59.55 USB1.2
  Bottom Layer w0.152: v1(30.61,58.8) 32.64,56.77 32.64,55.37 33.02,54.99 34.54,54.99 35.18,54.36 35.18,52.32 35.69,51.82 41.53,51.82 v1(48.01,45.34)
NRST: length 79.9
  Top Layer w0.152: J3.12 48.75,24.64 46.61,24.64 v1(45.47,25.78) ; U1.7 24.89,33.34 24.89,34.8 v1(23.37,36.32) ; v1(21.21,14.1) 21.21,11.18 R1.1 22.67,9.72 C20.2 22.67,5.27 20.83,3.43 15.92,3.43 RESET.1
  Bottom Layer w0.152: 21.08,22.05 21.09,22.05 41.73,22.05 v1(45.47,25.78) ; 21.08,22.05 21.21,21.93 v1(21.21,14.1) ; 21.08,22.05 21.08,34.04 v1(23.37,36.32)
OSC32IN: length 22.6
  Top Layer w0.152: U1.3 26.34,34.72 26.34,41.71 27.69,43.05 37.05,43.05 C2.2 37.89,45.73 X3.2
OSC32OUT: length 30.2
  Top Layer w0.152: X3.1 37.91,47.42 37.91,49.15 36.89,50.16 27.69,50.16 25.98,48.46 25.98,34.37 U1.4
OSC_IN: length 20.8
  Top Layer w0.152: 26.53,33.12 25.63,34.01 25.63,41.32 23.66,43.3 R3.2 21.67,44.99 19.37,44.99 19.33,44.96 C3.2
OSC_OUT: length 19.6
  Top Layer w0.152: 26.17,32.76 25.27,33.66 25.27,40.13 23.61,41.79 R3.1 21.71,40.13 14.83,40.13
PA0/WAKEUP: length 42.6
  Top Layer w0.152: v1(22.99,29.97) 21.21,28.19 19.81,28.19 19.3,28.7 19.3,29.84 21.46,32 24.1,32 24.76,31.35 ; R4.2 35.81,20.06 v1(35.81,18.92) ; v1(39.5,15.37) 39.5,14.73 39.06,14.29 WAKEUP.2 ; v1(26.8,22.73) v1(26.8,21.44)
  Bottom Layer w0.152: v1(22.99,29.97) 26.8,26.16 v1(26.8,22.73) ; v1(26.8,21.44) 31.77,21.44 34.29,18.92 v1(35.81,18.92) 37.85,18.92 39.5,17.27 v1(39.5,15.37)
PA1: length 25.6
  Top Layer w0.152: v1(20.45,29.97) 22.1,31.62 23.78,31.62 U1.11
  Bottom Layer w0.152: 5.21,43.05 7.37,43.05 v1(20.45,29.97)
PA2: length 24.8
  Top Layer w0.152: U1.12 23.45,31.24 22.73,31.24 v1(20.45,28.96)
  Bottom Layer w0.152: J1.7 8.89,40.51 v1(20.45,28.96)
PA3: length 33.4
  Top Layer w0.152: J1.8 6.73,37.97 9.14,35.56 9.14,26.14 12.83,22.45 17.7,22.45 U1.13
PA4: length 31.7
  Top Layer w0.152: J1.9 6.73,35.43 8.79,33.38 8.79,25.99 12.68,22.1 18.05,22.1 U1.14
PA5: length 29.9
  Top Layer w0.152: U1.15 18.4,21.74 12.53,21.74 8.43,25.84 8.43,31.19 6.73,32.89 J1.10
PA6: length 28.3
  Top Layer w0.152: J1.11 6.73,30.35 8.08,29.01 8.08,25.58 12.32,21.34 18.7,21.34 U1.16
PA7: length 25.8
  Top Layer w0.152: J1.12 12.06,20.95 19.03,20.95 U1.17
PA8: length 22.9
  Top Layer w0.152: U1.29 32.39,25.14 32.39,19.3 30.23,17.14 30.23,8.89 28.38,7.04 R6.1
PA9: length 32
  Top Layer w0.152: J3.20 49.15,8.16 49.15,9.77 41.9,17.02 35.43,17.02 33.66,18.8 33.66,24.57 U1.30
PA10: length 30
  Top Layer w0.152: J3.19 50.45,8.98 42.05,17.37 35.59,17.37 34.01,18.95 34.01,24.92 U1.31
PA11: length 28
  Top Layer w0.152: v1(46.99,28.32) v1(46.99,25.4) ; R10.2 v1(42.29,34.8)
  Bottom Layer w0.152: v1(46.99,28.32) 46.99,30.1 v1(42.29,34.8) ; J3.18 46.99,15.4 v1(46.99,25.4)
PA12: length 29.2
  Top Layer w0.152: R12.2 v1(42.29,38.52) ; v1(47.88,28.32) v1(47.88,25.4)
  Bottom Layer w0.152: J3.17 47.88,17.05 v1(47.88,25.4) ; v1(47.88,28.32) 47.88,32.93 v1(42.29,38.52)
PA15: length 20.9
  Top Layer w0.152: J3.11 49.95,30.23 44.45,30.23 42.29,28.07 38.61,28.07 34.67,32 34.32,32 U1.38
PB0: length 25.2
  Top Layer w0.152: J1.13 7.11,25.27 11.81,20.57 19.36,20.57 U1.18
PB1: length 24.7
  Top Layer w0.152: 26.17,26.68 19.68,20.19 11.56,20.19 9.02,22.73 J1.14
PB2: length 24.2
  Top Layer w0.152: U1.20 19.98,19.79 5.61,19.79 J1.15
PB3: length 21.5
  Top Layer w0.152: 32.96,31.35 34.12,32.51 34.67,32.51 38.76,28.42 42.14,28.42 45.56,31.84 J3.10
PB4: length 22.8
  Top Layer w0.152: J3.9 47.59,34.38 41.99,28.78 38.9,28.78 34.79,32.89 33.8,32.89 32.61,31.7
PB5: length 25.1
  Top Layer w0.152: J3.8 47.86,36.92 47.19,36.25 47.19,34.5 41.82,29.13 39.05,29.13 34.94,33.25 33.45,33.25 U1.41
PB6: length 26.6
  Top Layer w0.152: J3.7 49.37,39.46 46.84,36.93 46.84,34.65 41.68,29.49 39.22,29.49 35.1,33.6 33.09,33.6 U1.42
PB7: length 28.9
  Top Layer w0.152: J3.6 49.62,42 46.48,38.86 46.48,34.8 41.53,29.84 39.37,29.84 35.26,33.96 32.74,33.96 U1.43
PB8: length 27.8
  Top Layer w0.152: U1.45 49.53,52.16 J3.2
PB9: length 29.3
  Top Layer w0.152: J3.1 50.87,54.21 U1.46
PB10: length 25.1
  Top Layer w0.152: J1.16 6.73,17.65 8.51,19.43 20.33,19.43 U1.21
PB11: length 26.4
  Top Layer w0.152: U1.22 20.66,19.05 10.67,19.05 6.73,15.11 J1.17
PB12: length 34.4
  Top Layer w0.152: U1.25 30.61,24.09 v1(30.61,20.32)
  Bottom Layer w0.152: v1(30.61,20.32) 21.88,11.6 6.18,11.6 J1.18
PB13: length 12.2
  Top Layer w0.152: R9.1 28.38,17.2 31.24,20.07 31.24,24.16 30.13,25.27
PB14: length 15.7
  Top Layer w0.152: U1.27 31.62,24.48 31.62,19.78 29.34,17.49 29.34,13.72 28.38,12.76 R8.1
PB15: length 19.2
  Top Layer w0.152: R7.1 28.38,10.34 29.72,11.68 29.72,17.27 32,19.56 32,24.81 U1.28
PC13/TAMPER_RTC: length 29.6
  Top Layer w0.152: v1(27.43,37.72) 26.8,37.08 26.8,34.97 U1.2
  Bottom Layer w0.152: J1.5 6.35,45.59 14.22,37.72 v1(27.43,37.72)
SWCLK: length 20.5
  Top Layer w0.152: U1.37 34.49,31.46 34.7,31.46 38.48,27.69 42.42,27.69 45.88,24.22 J3.13
SWDIO: length 20.7
  Top Layer w0.152: U1.34 33.95,27.1 36.88,27.1 37.08,27.3 40.77,27.3 46.39,21.68 J3.14
$1N292: length 7.8
  Top Layer w0.152: R6.2 26.87,4.63 27.3,4.19 32,4.19 32.38,4.57 LED5.1
$1N400: length 8.3
  Top Layer w0.152: v1(32.38,7.37) LED4.1 ; R7.2 v1(26.87,7.37)
  Bottom Layer w0.152: v1(26.87,7.37) v1(32.38,7.37)
$1N509: length 8.4
  Top Layer w0.152: v1(26.87,10.29) R8.2 ; v1(32.38,10.29) LED3.1
  Bottom Layer w0.152: v1(26.87,10.29) v1(32.38,10.29)
$1N618: length 8.3
  Top Layer w0.152: 32.38,14.75 v1(32.38,13.33) ; v1(26.87,13.33) R9.2
  Bottom Layer w0.152: v1(26.87,13.33) v1(32.38,13.33)
$1N1383: length 4
  Top Layer w0.152: R5.2 32.34,2.79 LED1.1
$1N2109: length 13.9
  Top Layer w0.381: F1.2 40.75,58.15 40.26,57.66 33.84,57.66 USB1.1
$1N4818: length 37.5
  Top Layer w0.152: R2.2 37.46,21.34 37.47,21.33 v1(37.47,21.21)
  Bottom Layer w0.152: v1(37.47,21.21) 37.95,21.69 42.39,21.69 48.51,27.81 48.51,41.4 50.42,43.31 51.94,43.31 52.7,44.07 52.7,45.25 J3.4
$1N7464: length 24.2
  Top Layer w0.152: U1.33 33.68,26.67 v1(39.12,26.67) ; v1(38.23,37.59) 39.58,37.59 ; R14.1 R12.1 R13.1
  Bottom Layer w0.152: v1(38.23,37.59) 37.47,36.83 37.47,30.48 39.12,28.83 v1(39.12,26.67)
$1N7486: length 20.2
  Top Layer w0.152: R15.1 R11.1 R10.1 ; U1.32 33.35,26.29 38.36,26.29 38.99,25.65 v1(39.75,25.65) ; v1(38.23,32) 39.58,32
  Bottom Layer w0.152: v1(39.75,25.65) 39.75,28.7 38.23,30.23 v1(38.23,32)

## Copper pours and planes (outline as drawn; the poured copper is in the pictures)
GND on Top Layer: -4.44,67.56 64.01,67.56 64.01,-2.16 -4.44,-2.16
GND on Bottom Layer: -7.75,66.42 65.91,66.42 65.91,-1.02 -7.75,-1.02

Small or netless copper shapes (teardrops, artwork), in the pictures only: 398 on Top Layer, 88 on Bottom Layer

## Text on the board
Top Silkscreen Layer: 3V3 | GND | 5V | + | VDDA | PC13 | PB10 | PB12 | PB11 | PA1 | PA2 | PA3 | PA4 | PA5 | PA6 | PA7 | PB0 | PB1 | PB2 | PB9 | PB8 | BOOT0 | PB7 | PB6 | PB5 | PB4 | PB3 | PA15 | NRST | SWCLK | SWDIO | PA12 | PA11 | PA10 | PA9
